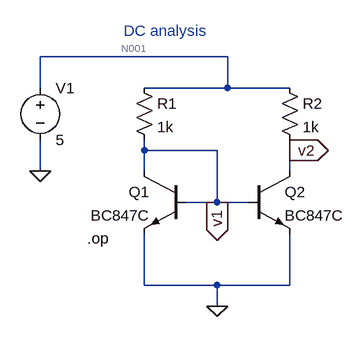
[diagram p0: schematic Draft5.asc]
Draft5.asc, the LTspice schematic file:
Version 4
SHEET 1 880 680
WIRE 304 64 16 64
WIRE 16 112 16 64
WIRE 304 112 304 64
WIRE 304 112 176 112
WIRE 400 112 304 112
WIRE 176 208 176 192
WIRE 288 208 176 208
WIRE 400 208 400 192
WIRE 16 240 16 192
WIRE 176 240 176 208
WIRE 400 240 400 208
WIRE 288 288 288 208
WIRE 288 288 240 288
WIRE 336 288 288 288
WIRE 176 416 176 336
WIRE 288 416 176 416
WIRE 400 416 400 336
WIRE 400 416 288 416
WIRE 288 448 288 416
FLAG 16 240 0
FLAG 288 448 0
FLAG 288 288 v1
IOPIN 288 288 Out
FLAG 400 208 v2
IOPIN 400 208 Out
SYMBOL voltage 16 96 R0
SYMATTR InstName V1
SYMATTR Value 5
SYMBOL npn 240 240 M0
SYMATTR InstName Q1
SYMATTR Value BC847C
SYMBOL npn 336 240 R0
SYMATTR InstName Q2
SYMATTR Value BC847C
SYMBOL res 160 96 R0
SYMATTR InstName R1
SYMATTR Value 1k
SYMBOL res 384 96 R0
SYMATTR InstName R2
SYMATTR Value 1k
TEXT 144 24 Left 2 ;DC analysis
TEXT 88 344 Left 2 !.op

The netlist it stands for:
* Draft5.asc
V1 N001 0 5
Q1 v1 v1 0 0 BC847C
Q2 v2 v1 0 0 BC847C
R1 N001 v1 1k
R2 N001 v2 1k
.model NPN NPN
.model PNP PNP
.lib standard.bjt
* DC analysis
.op
.backanno
.end

* Results of the author's LTspice run, read from the files saved beside the schematic
* Operating Point:
*   V(n001) = 5 V
*   V(v1) = 679.4 mV
*   V(v2) = 702.1 mV
*   Ic(Q1) = 4.297 mA
*   Ib(Q1) = 11.98 µA
*   Ie(Q1) = -4.309 mA
*   Ic(Q2) = 4.298 mA
*   Ib(Q2) = 11.98 µA
*   Ie(Q2) = -4.31 mA
*   I(R1) = 4.321 mA
*   I(R2) = 4.298 mA
*   I(V1) = -8.618 mA
* From the log:
*   Semiconductor Device Operating Points:
*                           --- Bipolar Transistors ---
*   Name:       q1          q2
*   Model:    bc847c      bc847c
*   Ib:       1.20e-05    1.20e-05
*   Ic:       4.30e-03    4.30e-03
*   Vbe:      6.79e-01    6.79e-01
*   Vbc:      0.00e+00   -2.27e-02
*   Vce:      6.79e-01    7.02e-01
*   BetaDC:   3.59e+02    3.59e+02
*   Gm:       1.66e-01    1.66e-01
*   Rpi:      2.16e+03    2.16e+03
*   Rx:       1.00e+01    1.00e+01
*   Ro:       1.51e+04    1.51e+04
*   Cbe:      1.12e-10    1.12e-10
*   Cbc:      2.01e-11    1.99e-11
*   Cjs:      0.00e+00    0.00e+00
*   BetaAC:   3.57e+02    3.58e+02
*   Cbx:      0.00e+00    0.00e+00
*   Ft:       1.99e+08    2.00e+08